# EAGLE design i2c_level_bridge (EAGLE 5.11)
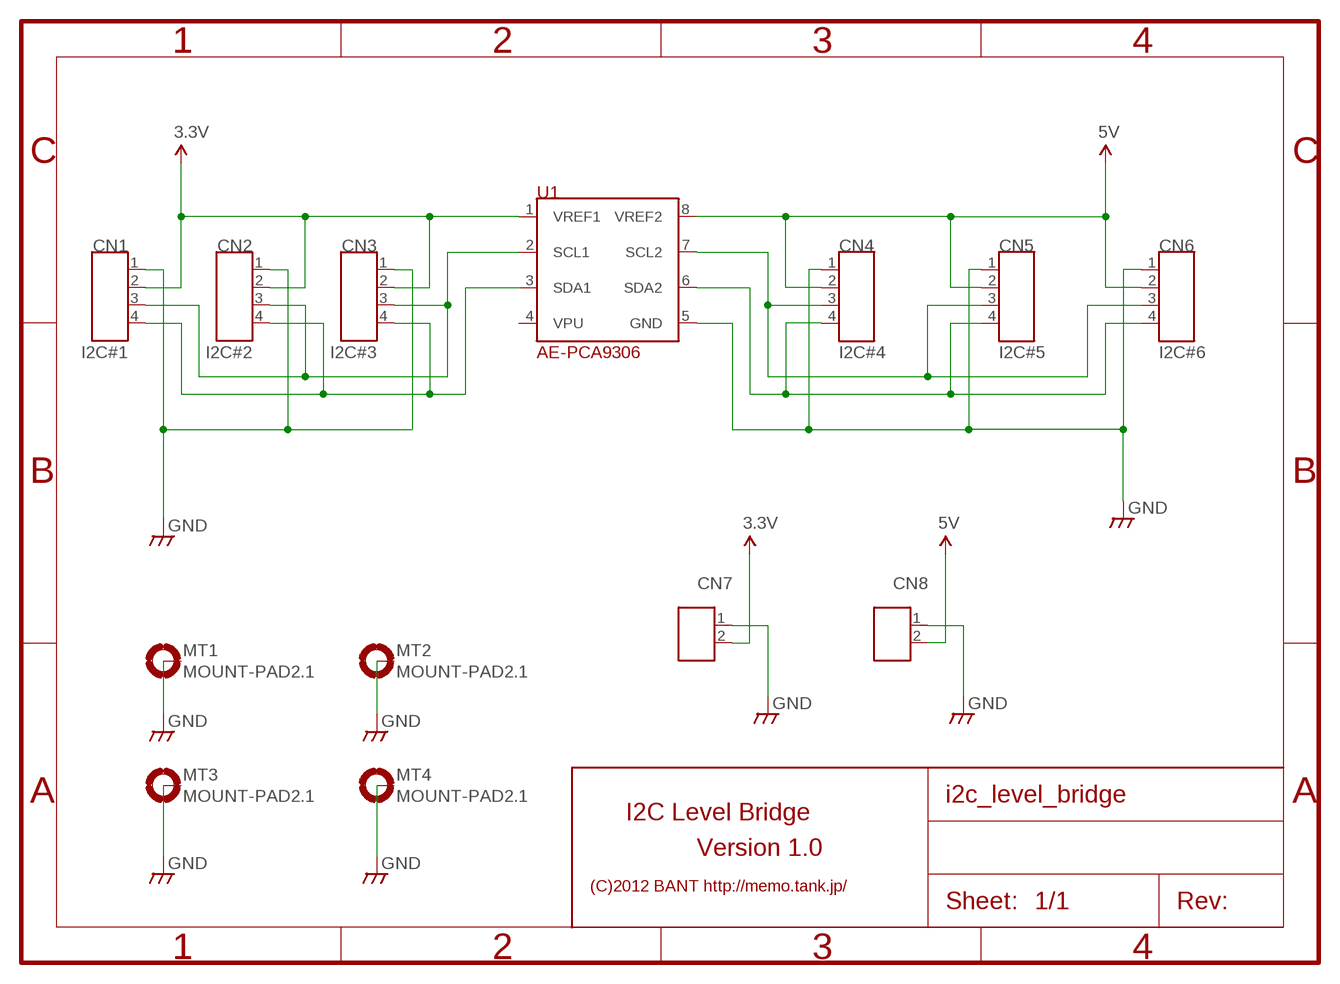
[diagram p0: schematic, sheet 1]

## Parts
CN1  I2C#1  CON_4P  [CON_HRS_DIP_4]
CN2  I2C#2  CON_4P  [CON_HRS_DIP_4]
CN3  I2C#3  CON_4P  [CON_HRS_DIP_4]
CN4  I2C#4  CON_4P  [CON_HRS_DIP_4]
CN5  I2C#5  CON_4P  [CON_HRS_DIP_4]
CN6  I2C#6  CON_4P  [CON_HRS_DIP_4]
CN7  CON_2P  [CON_HRS_DIP_2]
CN8  CON_2P  [CON_HRS_DIP_2]
MT1  MOUNT-PAD2.1  [PAD-2.1]
MT2  MOUNT-PAD2.1  [PAD-2.1]
MT3  MOUNT-PAD2.1  [PAD-2.1]
MT4  MOUNT-PAD2.1  [PAD-2.1]
U1  AE-PCA9306  [DIL08]

## Nets
3.3V: CN1.2 CN2.2 CN3.2 CN7.2 U1.1(VREF1)
5V: CN4.2 CN5.2 CN6.2 CN8.2 U1.8(VREF2)
GND: CN1.1 CN2.1 CN3.1 CN4.1 CN5.1 CN6.1 CN7.1 CN8.1 MT1.B2,1(MOUNT) MT2.B2,1(MOUNT) MT3.B2,1(MOUNT) MT4.B2,1(MOUNT) U1.5(GND)
N$1: CN4.3 CN5.3 CN6.3 U1.7(SCL2)
N$2: CN4.4 CN5.4 CN6.4 U1.6(SDA2)
N$14: CN1.3 CN2.3 CN3.3 U1.2(SCL1)
N$16: CN1.4 CN2.4 CN3.4 U1.3(SDA1)

## Notes on the sheet
- I2C Level Bridge
- Version 1.0
- (C)2012 BANT http://memo.tank.jp/

## Power pins joined to a net without a drawn wire
VPU: U1.4(VPU)

## Library data of the parts
CN1-CN6 = MyLib:CON_4P: 4P Molex Connector
CN7 CN8 = MyLib:CON_2P: 2P Molex Connector
MT1-MT4 = MyLib:MOUNT-PAD: 2.1mm Mount Pad (Connectable to GND)
U1 = bant:AE-PCA9306

## Board
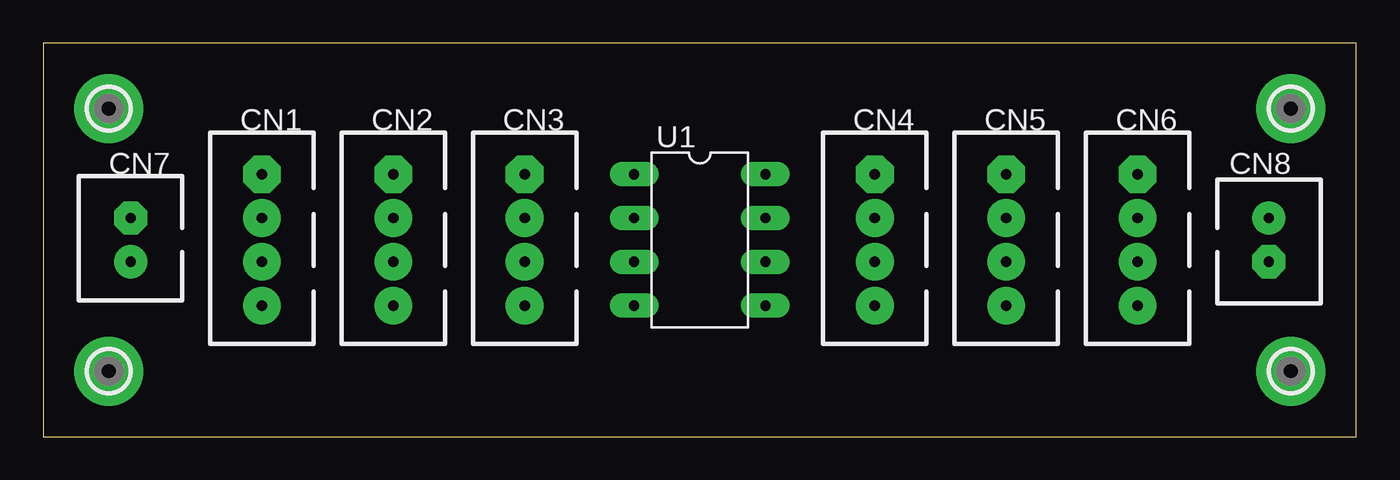
[diagram p1: board, top side]
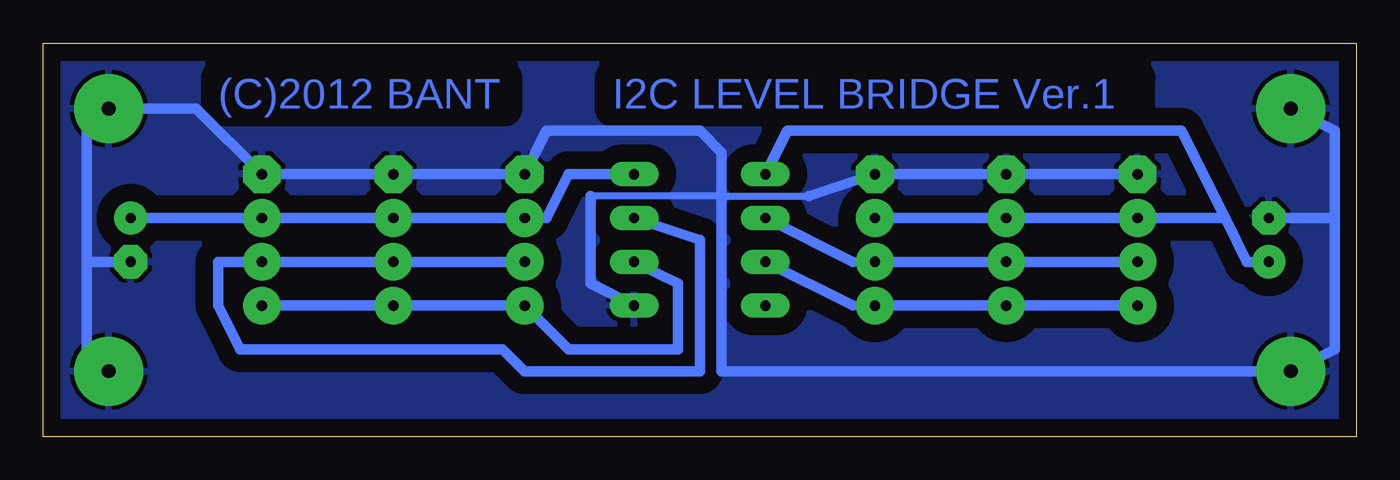
[diagram p2: board, bottom side, seen from below]

Size 76.2 x 22.86 mm. Coordinates in mm from the lower left corner, seen from the top.
Outline: 0,0 76.2,0 76.2,22.86 0,22.86 0,0
Copper layers (1*16): Top 0.035mm / dielectric 1.5mm / Bottom 0.035mm
Design rules "default": minimum track width 10mil, minimum drill 24mil, track to track 8mil, track to pad 8mil, pad to pad 8mil, via to via 8mil, smd to smd 8mil, copper to edge 40mil, drill to drill 8mil, minimum pad ring 10mil, minimum via ring 8mil, stop-mask expansion 4mil, vias tented up to drill 0mil, thermal gap 10mil

### Footprints (pad centres in the part's own frame; a part is rotated, then mirrored left to right if it is on the bottom)
CON_HRS_DIP_4 = drill 0.6 pad 2.184 octagon: 1 -3.81,0 | drill 0.6 pad 2.184 round: 2 -1.27,0; 3 1.27,0; 4 3.81,0
CON_HRS_DIP_2 = drill 0.6 pad 1.93 octagon: 1 -1.27,0 | drill 0.6 pad 1.93 round: 2 1.27,0
PAD-2.1 = drill 0.8 pad 4 round: B2,1 0,0
DIL08 = drill 0.6 pad 1.422 long: 1 -3.81,-3.81; 2 -1.27,-3.81; 3 1.27,-3.81; 4 3.81,-3.81; 5 3.81,3.81; 6 1.27,3.81; 7 -1.27,3.81; 8 -3.81,3.81

### Placement (x,y rotation side)
CN1  12.7,11.43 270 top
CN2  20.32,11.43 270 top
CN3  27.94,11.43 270 top
CN4  48.26,11.43 270 top
CN5  55.88,11.43 270 top
CN6  63.5,11.43 270 top
CN7  5.08,11.43 270 top
CN8  71.12,11.43 90 top
MT1  72.39,19.05 0 top
MT2  3.81,3.81 0 top
MT3  3.81,19.05 0 top
MT4  72.39,3.81 0 top
U1  38.1,11.43 270 top

### Tracks (layer width: path | path; a pad name or v marks a point on that pad's centre or on a via)
3.3V
  Bottom 0.61: U1.1 33.02,17.78 10.16,17.78 7.62,12.7 | 7.62,12.7 CN1.2 CN2.2 CN3.2 | 7.62,12.7 6.35,10.16 CN7.2
5V
  Bottom 0.61: U1.8 45.72,15.24 46.99,12.7 CN4.2 CN5.2 CN6.2 66.04,12.7 CN8.2
GND
  Bottom 0.406: 31.75,13.97 36.83,13.97 44.45,13.97
  Bottom 0.61: CN1.1 CN2.1 CN3.1 31.75,13.97 | U1.5 44.45,8.89 44.45,13.97 | 73.66,10.16 73.66,17.78 MT1.B2,1 67.31,19.05 CN6.1 CN5.1 CN4.1 46.99,17.78 38.1,17.78 36.83,16.51 36.83,13.97 36.83,3.81 MT2.B2,1 1.27,5.08 1.27,12.7 | 73.66,10.16 73.66,5.08 MT4.B2,1 | MT3.B2,1 1.27,17.78 1.27,12.7 | 1.27,12.7 CN7.1 | 73.66,10.16 CN8.1
  pour Bottom (isolate 1.016): 0,24.13 -1.27,24.13 -1.27,-1.27 78.74,-1.27 78.74,24.13
N$1
  Bottom 0.61: CN4.3 CN5.3 CN6.3 66.04,10.16 66.04,7.62 64.77,5.08 49.53,5.08 48.26,3.81 38.1,3.81 38.1,11.43 U1.7
N$2
  Bottom 0.61: U1.6 39.37,8.89 39.37,5.08 45.72,5.08 CN4.4 CN5.4 CN6.4
N$14
  Bottom 0.406: CN3.3 29.21,10.16
  Bottom 0.61: 29.21,10.16 U1.2 | CN1.3 CN2.3 CN3.3
N$16
  Bottom 0.406: CN3.4 29.21,7.62
  Bottom 0.61: 29.21,7.62 U1.3 | CN1.4 CN2.4 CN3.4

### Text on the board
Bottom: I2C LEVEL BRIDGE Ver.1 | (C)2012 BANT